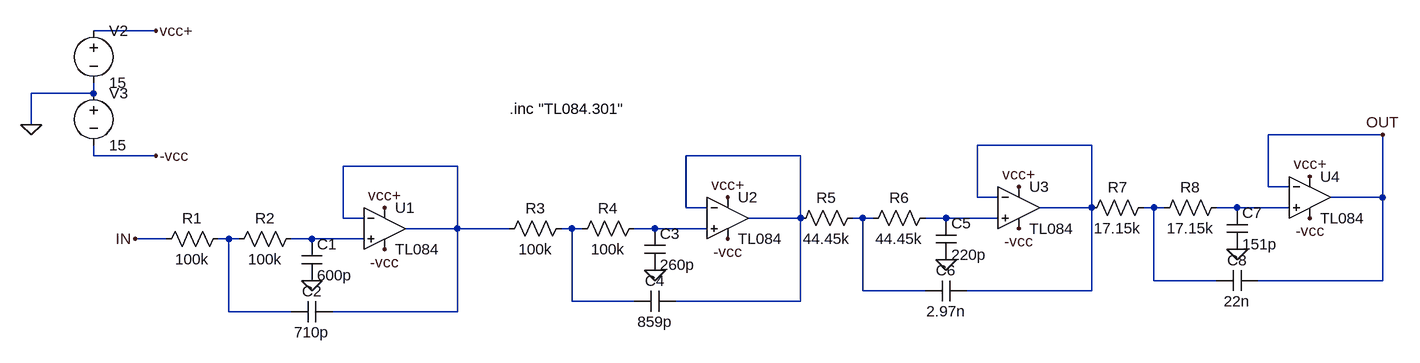
[diagram p0: schematic FAA.asc]
FAA.asc, the LTspice schematic file:
Version 4
SHEET 1 3080 680
WIRE 144 -192 48 -192
WIRE 48 -96 48 -112
WIRE 48 -96 -48 -96
WIRE -48 -48 -48 -96
WIRE 2032 -32 1856 -32
WIRE 1584 -16 1408 -16
WIRE 48 0 48 -16
WIRE 144 0 48 0
WIRE 1136 0 960 0
WIRE 608 16 432 16
WIRE 1856 48 1856 -32
WIRE 1888 48 1856 48
WIRE 1408 64 1408 -16
WIRE 1440 64 1408 64
WIRE 2032 64 2032 -32
WIRE 2032 64 1952 64
WIRE 960 80 960 0
WIRE 992 80 960 80
WIRE 1584 80 1584 -16
WIRE 1584 80 1504 80
WIRE 1680 80 1664 80
WIRE 1696 80 1680 80
WIRE 1808 80 1776 80
WIRE 1888 80 1808 80
WIRE 432 96 432 16
WIRE 464 96 432 96
WIRE 1136 96 1136 0
WIRE 1136 96 1056 96
WIRE 1232 96 1216 96
WIRE 1248 96 1232 96
WIRE 1360 96 1328 96
WIRE 1440 96 1360 96
WIRE 608 112 608 16
WIRE 608 112 528 112
WIRE 688 112 608 112
WIRE 784 112 768 112
WIRE 800 112 784 112
WIRE 912 112 880 112
WIRE 992 112 912 112
WIRE 160 128 112 128
WIRE 256 128 240 128
WIRE 272 128 256 128
WIRE 384 128 352 128
WIRE 464 128 384 128
WIRE 1680 192 1680 80
WIRE 1776 192 1680 192
WIRE 2032 192 2032 64
WIRE 2032 192 1840 192
WIRE 1232 208 1232 96
WIRE 1328 208 1232 208
WIRE 1584 208 1584 80
WIRE 1584 208 1392 208
WIRE 784 224 784 112
WIRE 880 224 784 224
WIRE 1136 224 1136 96
WIRE 1136 224 944 224
WIRE 256 240 256 128
WIRE 352 240 256 240
WIRE 608 240 608 112
WIRE 608 240 416 240
FLAG 144 -192 vcc+
FLAG 496 80 vcc+
FLAG 144 0 -vcc
FLAG 496 144 -vcc
FLAG -48 -48 0
FLAG 384 192 0
FLAG 1024 64 vcc+
FLAG 1024 128 -vcc
FLAG 912 176 0
FLAG 1472 48 vcc+
FLAG 1472 112 -vcc
FLAG 1360 160 0
FLAG 1920 32 vcc+
FLAG 1920 96 -vcc
FLAG 1808 144 0
FLAG 112 128 IN
FLAG 2032 -32 OUT
SYMBOL Opamps\\opamp2 496 48 R0
SYMATTR InstName U1
SYMATTR Value TL084
SYMBOL voltage 48 -208 R0
SYMATTR InstName V2
SYMATTR Value 15
SYMBOL voltage 48 -112 R0
SYMATTR InstName V3
SYMATTR Value 15
SYMBOL res 256 112 R90
WINDOW 0 0 56 VBottom 2
WINDOW 3 32 56 VTop 2
SYMATTR InstName R1
SYMATTR Value 100k
SYMBOL res 368 112 R90
WINDOW 0 0 56 VBottom 2
WINDOW 3 32 56 VTop 2
SYMATTR InstName R2
SYMATTR Value 100k
SYMBOL cap 368 128 R0
SYMATTR InstName C1
SYMATTR Value 600p
SYMBOL cap 416 224 R90
WINDOW 0 0 32 VBottom 2
WINDOW 3 32 32 VTop 2
SYMATTR InstName C2
SYMATTR Value 710p
SYMBOL Opamps\\opamp2 1024 32 R0
SYMATTR InstName U2
SYMATTR Value TL084
SYMBOL res 784 96 R90
WINDOW 0 0 56 VBottom 2
WINDOW 3 32 56 VTop 2
SYMATTR InstName R3
SYMATTR Value 100k
SYMBOL res 896 96 R90
WINDOW 0 0 56 VBottom 2
WINDOW 3 32 56 VTop 2
SYMATTR InstName R4
SYMATTR Value 100k
SYMBOL cap 896 112 R0
SYMATTR InstName C3
SYMATTR Value 260p
SYMBOL cap 944 208 R90
WINDOW 0 0 32 VBottom 2
WINDOW 3 32 32 VTop 2
SYMATTR InstName C4
SYMATTR Value 859p
SYMBOL Opamps\\opamp2 1472 16 R0
SYMATTR InstName U3
SYMATTR Value TL084
SYMBOL res 1232 80 R90
WINDOW 0 0 56 VBottom 2
WINDOW 3 32 56 VTop 2
SYMATTR InstName R5
SYMATTR Value 44.45k
SYMBOL res 1344 80 R90
WINDOW 0 0 56 VBottom 2
WINDOW 3 32 56 VTop 2
SYMATTR InstName R6
SYMATTR Value 44.45k
SYMBOL cap 1344 96 R0
SYMATTR InstName C5
SYMATTR Value 220p
SYMBOL cap 1392 192 R90
WINDOW 0 0 32 VBottom 2
WINDOW 3 32 32 VTop 2
SYMATTR InstName C6
SYMATTR Value 2.97n
SYMBOL Opamps\\opamp2 1920 0 R0
SYMATTR InstName U4
SYMATTR Value TL084
SYMBOL res 1680 64 R90
WINDOW 0 0 56 VBottom 2
WINDOW 3 32 56 VTop 2
SYMATTR InstName R7
SYMATTR Value 17.15k
SYMBOL res 1792 64 R90
WINDOW 0 0 56 VBottom 2
WINDOW 3 32 56 VTop 2
SYMATTR InstName R8
SYMATTR Value 17.15k
SYMBOL cap 1792 80 R0
SYMATTR InstName C7
SYMATTR Value 151p
SYMBOL cap 1840 176 R90
WINDOW 0 0 32 VBottom 2
WINDOW 3 32 32 VTop 2
SYMATTR InstName C8
SYMATTR Value 22n
TEXT 688 -72 Left 2 !.inc "TL084.301"

The netlist it stands for:
* FAA.asc
XU1 N011 N003 vcc+ -vcc N003 TL084  ; pins In+ In- V+ V- OUT
V2 vcc+ 0 15
V3 0 -vcc 15
R1 N010 IN 100k
R2 N011 N010 100k
C1 N011 0 600p
C2 N003 N010 710p
XU2 N009 N002 vcc+ -vcc N002 TL084  ; pins In+ In- V+ V- OUT
R3 N008 N003 100k
R4 N009 N008 100k
C3 N009 0 260p
C4 N002 N008 859p
XU3 N007 N001 vcc+ -vcc N001 TL084  ; pins In+ In- V+ V- OUT
R5 N006 N002 44.45k
R6 N007 N006 44.45k
C5 N007 0 220p
C6 N001 N006 2.97n
XU4 N005 OUT vcc+ -vcc OUT TL084  ; pins In+ In- V+ V- OUT
R7 N004 N001 17.15k
R8 N005 N004 17.15k
C7 N005 0 151p
C8 OUT N004 22n
.inc "TL084.301"
.backanno
.end